# EAGLE design ESC試作 (EAGLE 9.6.2)
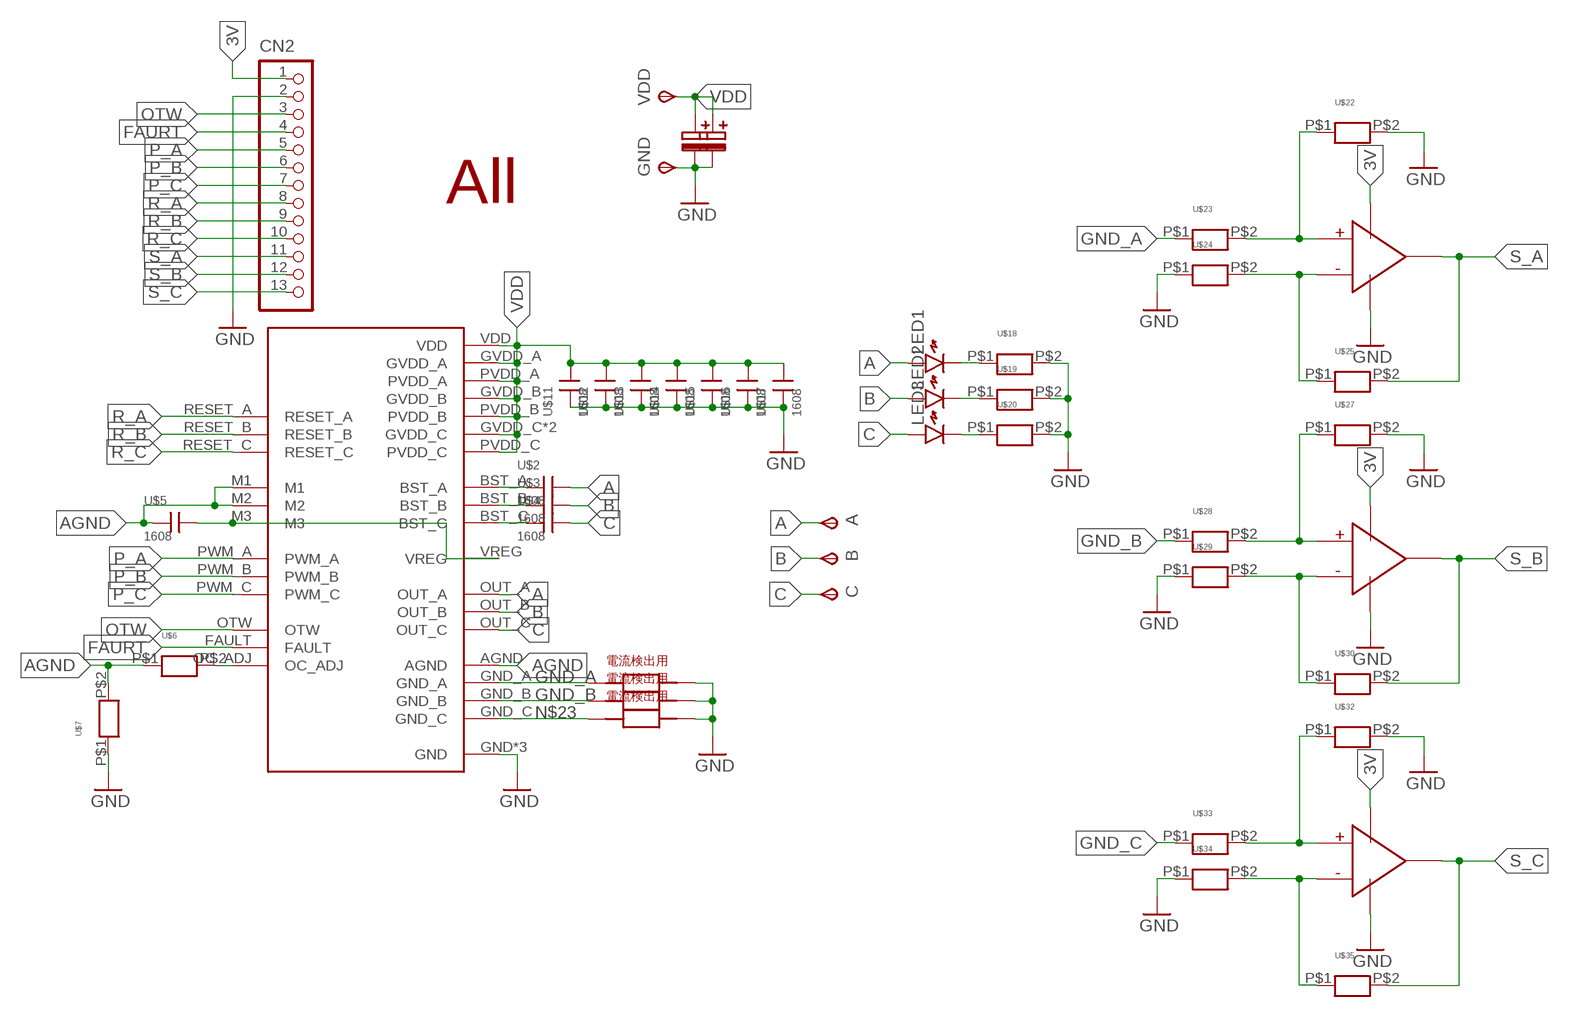
[diagram p0: schematic, sheet 1]

## Parts
A  TPSPAD1-20  [P1-20]
B  TPSPAD1-20  [P1-20]
C  TPSPAD1-20  [P1-20]
CN2  B13B-XH-A  [B13B-XH-A]
GND  TPSPAD1-20  [P1-20]
LED1  LED1608  [LED1608]
LED2  LED1608  [LED1608]
LED3  LED1608  [LED1608]
U$1  DRV8332  [DRV8332]
U$2  1608  [CON]
U$3  1608  [CON]
U$4  1608  [CON]
U$5  1608  [CON]
U$6  R  [1608]
U$7  R  [1608]
U$8  R0.1  [R0.1]
U$9  R0.1  [R0.1]
U$10  R0.1  [R0.1]
U$11  1608  [CON]
U$12  1608  [CON]
U$13  1608  [CON]
U$14  1608  [CON]
U$15  1608  [CON]
U$16  1608  [CON]
U$17  1608  [CON]
U$18  R  [1608]
U$19  R  [1608]
U$20  R  [1608]
U$21  77701  [77701]
U$22  R  [1608]
U$23  R  [1608]
U$24  R  [1608]
U$25  R  [1608]
U$26  77701  [77701]
U$27  R  [1608]
U$28  R  [1608]
U$29  R  [1608]
U$30  R  [1608]
U$31  77701  [77701]
U$32  R  [1608]
U$33  R  [1608]
U$34  R  [1608]
U$35  R  [1608]
U$36  25V100  [25V100]
U$37  25V100  [25V100]
U$38  ALL  [ALL]
VDD  TPSPAD1-20  [P1-20]

## Nets
3V: CN2.1 U$21.VIN U$26.VIN U$31.VIN
A: A.TP(PP) LED1.A U$1.OUT_A U$2.P$1
AGND: U$1.AGND U$1.M1 U$1.M2 U$5.P$2 U$6.P$1 U$7.P$2
B: B.TP(PP) LED2.A U$1.OUT_B U$3.P$1
C: C.TP(PP) LED3.A U$1.OUT_C U$4.P$1
FAURT: CN2.4 U$1.FAULT
GND: CN2.2 GND.TP(PP) U$1.GND U$1.GND1(GND) U$1.GND2(GND) U$7.P$1 U$8.P$2 U$9.P$2 U$10.P$2 U$11.P$2 U$12.P$2 U$13.P$2 U$14.P$2 U$15.P$2 U$16.P$2 U$17.P$2 U$18.P$2 U$19.P$2 U$20.P$2 U$21.VOUT U$22.P$2 U$24.P$1 U$26.VOUT U$27.P$2 U$29.P$1 U$31.VOUT U$32.P$2 U$34.P$1 U$36.P$2 U$37.P$2
GND_A: U$1.GND_A U$8.P$1 U$23.P$1
GND_B: U$1.GND_B U$9.P$1 U$28.P$1
GND_C: U$33.P$1
N$4: U$21.+ U$22.P$1 U$23.P$2
N$5: U$21.- U$24.P$2 U$25.P$1
N$6: U$1.M3 U$1.VREG U$5.P$1
N$7: LED3.K U$20.P$1
N$8: LED2.K U$19.P$1
N$9: LED1.K U$18.P$1
N$11: U$26.+ U$27.P$1 U$28.P$2
N$12: U$26.- U$29.P$2 U$30.P$1
N$13: U$31.+ U$32.P$1 U$33.P$2
N$14: U$31.- U$34.P$2 U$35.P$1
N$23: U$1.GND_C U$10.P$1
N$30: U$1.BST_A U$2.P$2
N$31: U$1.BST_B U$3.P$2
N$32: U$1.BST_C U$4.P$2
N$36: U$1.OC_ADJ U$6.P$2
OTW: CN2.3 U$1.OTW
P_A: CN2.5 U$1.PWM_A
P_B: CN2.6 U$1.PWM_B
P_C: CN2.7 U$1.PWM_C
R_A: CN2.8 U$1.RESET_A
R_B: CN2.9 U$1.RESET_B
R_C: CN2.10 U$1.RESET_C
S_A: CN2.11 U$21.O U$25.P$2
S_B: CN2.12 U$26.O U$30.P$2
S_C: CN2.13 U$31.O U$35.P$2
VDD: U$1.GVDD_A U$1.GVDD_B U$1.GVDD_C U$1.GVDD_C2(GVDD_C) U$1.PVDD_A U$1.PVDD_B U$1.PVDD_C U$1.VDD U$11.P$1 U$12.P$1 U$13.P$1 U$14.P$1 U$15.P$1 U$16.P$1 U$17.P$1 U$36.P$1 U$37.P$1 VDD.TP(PP)

## Library data of the parts
A B C GND VDD = testpad:TPS: TEST PIN
CN2 = jst-xh:B13B-XH-A: Wire-to-Board 2.5mm pitch top mount connector Source: http://www.jst-mfg.com/product/pdf/jpn/XH.pdf http://www.jst-mfg.com/product/detail.php?series=277
LED1-LED3 = generic:LED: Generic LEDs
U$1 = DRV8332:DRV8332
U$2-U$5 U$11-U$17 = con1608:1608
U$6 U$7 U$18-U$20 U$22-U$25 U$27-U$30 U$32-U$35 = R 1608:R
U$8-U$10 = R 1W0.1Ω:R0.1
U$21 U$26 U$31 = 77701:77701
U$36 U$37 = 100uF25V 電解:25V100
U$38 = All_outlook:ALL

## Net classes
0 default: width 0.33 mm

## Board
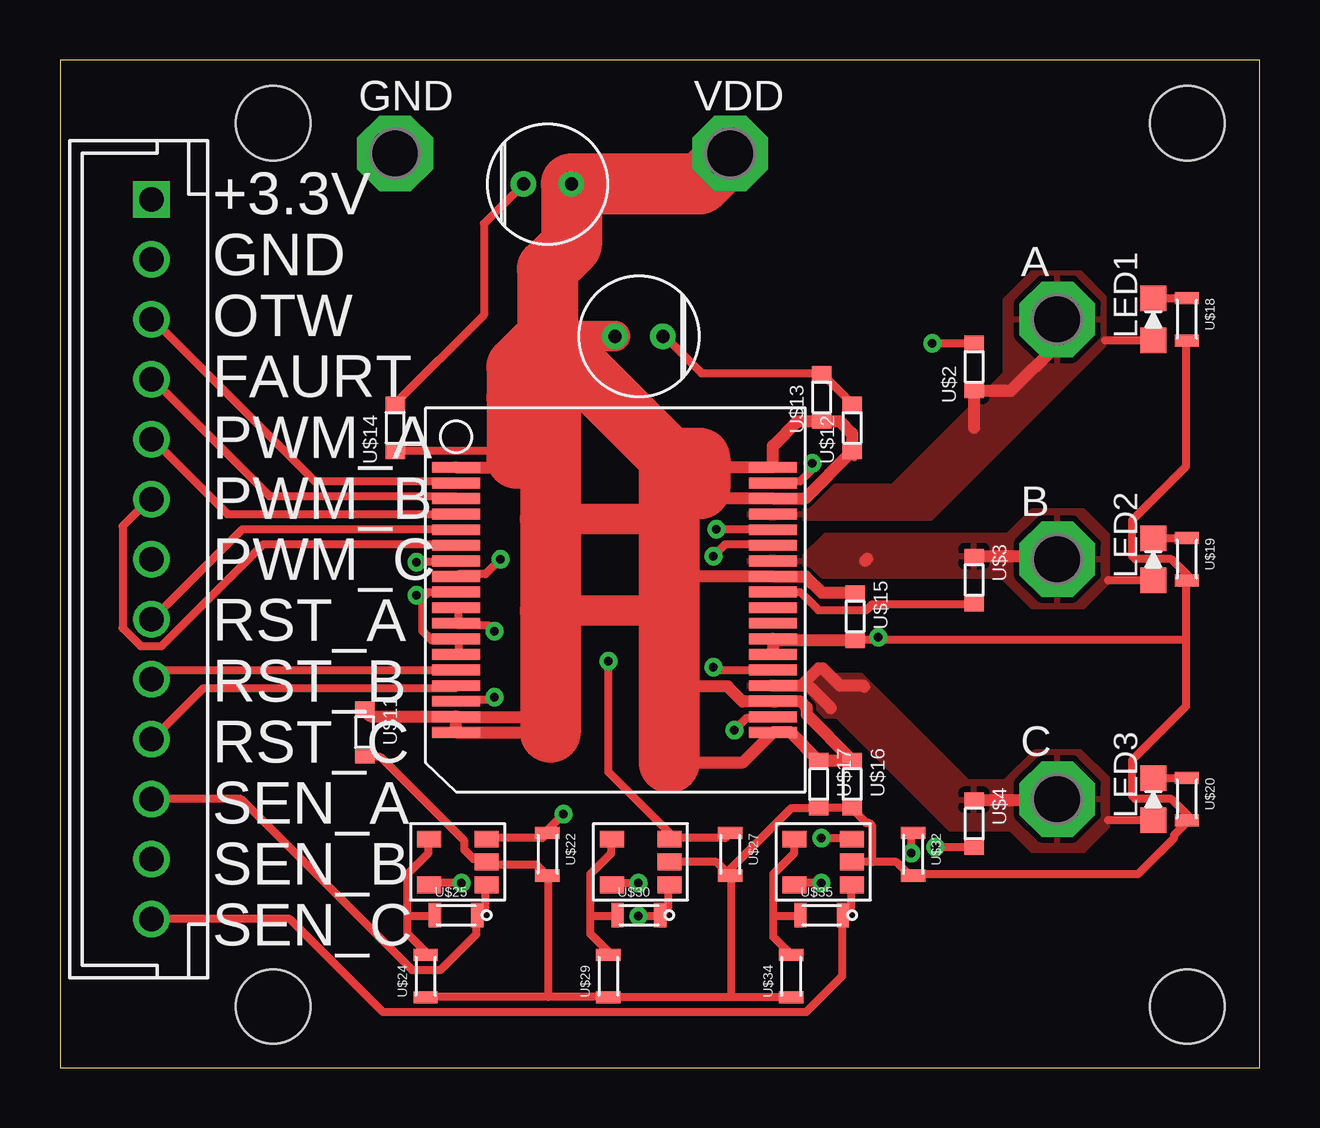
[diagram p1: board, top side]
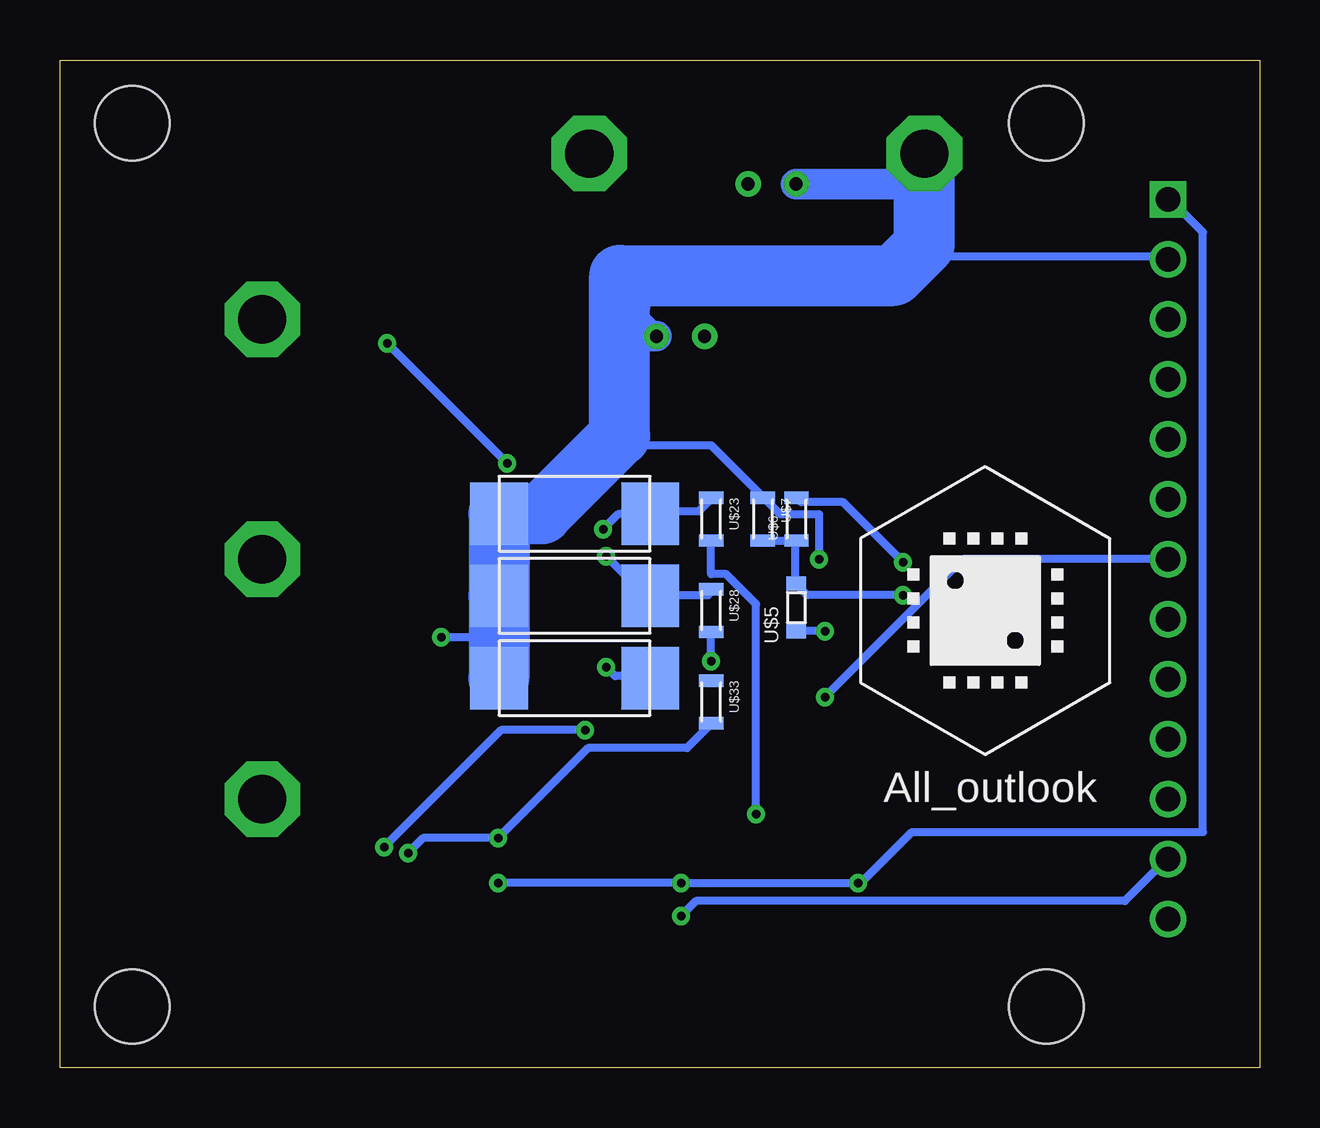
[diagram p2: board, bottom side, seen from below]

Size 50 x 42 mm. Coordinates in mm from the lower left corner, seen from the top.
Outline: 0,0 50,0 50,42 0,42 0,0
Copper layers (1*16): Top 0.035mm / dielectric 1.5mm / Bottom 0.035mm
Design rules "default": minimum track width 6mil, minimum drill 0.35mm, track to track 6mil, track to pad 6mil, pad to pad 6mil, via to via 6mil, smd to smd 6mil, copper to edge 40mil, drill to drill 6mil, minimum pad ring 10mil, minimum via ring 8mil, stop-mask expansion 4mil, vias tented up to drill 0mil, thermal gap 10mil
Holes 3.1 mm at 8.89,39.37 8.89,2.54 46.99,2.54 46.99,39.37

### Footprints (pad centres in the part's own frame; a part is rotated, then mirrored left to right if it is on the bottom)
P1-20 = drill 2.007 pad 3.15 octagon: TP 0,0
B13B-XH-A = drill 1.016 square: 1 -15,0 | drill 1.016: 2 -12.5,0; 3 -10,0; 4 -7.5,0; 5 -5,0; 6 -2.5,0; 7 0,0; 8 2.5,0; 9 5,0; 10 7.5,0; 11 10,0; 12 12.5,0; 13 15,0
LED1608 = smd 1.05 x 1.08: A -0.875,0; K 0.875,0
DRV8332 = smd 2 x 0.45: AGND 0,5.85; BST_A 13.2,10.4; BST_B 13.2,5.85; BST_C 13.2,0.65; FAULT 0,9.75; GND 0,6.5; GND1 13.2,3.9; GND2 13.2,3.25; GND_A 13.2,8.45; GND_B 13.2,7.8; GND_C 13.2,2.6; GVDD_A 13.2,11.05; GVDD_B 0,11.05; GVDD_C 0,0; GVDD_C2 13.2,0; M1 0,3.25; M2 0,3.9; M3 0,4.55; NC 13.2,5.2; NC2 13.2,4.55; OC_ADJ 0,7.15; OTW 0,10.4; OUT_A 13.2,9.1; OUT_B 13.2,7.15; OUT_C 13.2,1.95; PVDD_A 13.2,9.75; PVDD_B 13.2,6.5; PVDD_C 13.2,1.3; PWM_A 0,9.1; PWM_B 0,7.8; PWM_C 0,1.3; RESET_A 0,8.45; RESET_B 0,2.6; RESET_C 0,1.95; VDD 0,0.65; VREG 0,5.2
CON = smd 0.6 x 0.813: P$1 -1,0; P$2 1,0
1608 = smd 0.508 x 1.016: P$1 -0.889,0; P$2 0.889,0
R0.1 = smd 2.4 x 2.6: P$1 0,1.55; P$2 6.3,1.55
77701 = smd 0.7 x 1: + 1.9,0; - 1.9,2.4; O 0,0; VIN 0,2.4; VOUT 0.95,0
25V100 = drill 0.55: P$1 -1,0; P$2 1,0

### Placement (x,y rotation side)
A  41.57,31.19 0 top
B  41.57,21.19 0 top
C  41.57,11.19 0 top
CN2  3.81,21.19 270 top
GND  13.97,38.1 0 top
LED1  45.57,31.19 90 top
LED2  45.57,21.19 90 top
LED3  45.57,11.19 90 top
U$1  16.51,13.97 0 top
U$2  38.1,29.21 90 top
U$3  38.1,20.32 270 top
U$4  38.1,10.16 270 top
U$5  19.3,19.18 90 bottom
U$6  19.3,22.86 90 bottom
U$7  20.7,22.86 270 bottom
U$8  25.4,24.64 180 bottom
U$9  25.4,21.21 180 bottom
U$10  25.4,17.78 180 bottom
U$11  12.7,13.97 270 top
U$12  33.02,26.67 90 top
U$13  31.75,27.94 90 top
U$14  13.97,26.67 90 top
U$15  33.15,18.8 270 top
U$16  33.02,11.81 270 top
U$17  31.62,11.81 270 top
U$18  46.97,31.19 270 top
U$19  46.97,21.19 270 top
U$20  46.97,11.19 270 top
U$21  17.78,7.62 90 top
U$22  20.32,8.89 270 top
U$23  22.86,22.86 270 bottom
U$24  15.24,3.81 90 top
U$25  16.51,6.35 0 top
U$26  25.4,7.62 90 top
U$27  27.94,8.89 270 top
U$28  22.86,19.05 270 bottom
U$29  22.86,3.81 90 top
U$30  24.13,6.35 0 top
U$31  33.02,7.62 90 top
U$32  35.56,8.89 270 top
U$33  22.86,15.24 270 bottom
U$34  30.48,3.81 90 top
U$35  31.75,6.35 0 top
U$36  20.32,36.83 180 top
U$37  24.13,30.48 0 top
U$38  11.43,19.05 0 bottom
VDD  27.94,38.1 0 top

### Tracks (layer width: path | path; a pad name or v marks a point on that pad's centre or on a via)
3V  (via drill 0.35)
  Top 0.33: v16.73,7.69 15.48,7.69 U$21.VIN | v24.11,7.69 23.11,7.69 U$26.VIN | v31.73,7.69 30.73,7.69 U$31.VIN
  Bottom 0.33: v31.73,7.69 v24.11,7.69 v16.73,7.69 16.61,7.69 14.48,9.81 2.36,9.81 2.36,34.81 3.73,36.19 CN2.1
A
  Top 0.33: 43.56,30.32 LED1.A
  Top 0.508: A.TP 41.57,30.14 39.64,28.21 U$2.P$1 38.1,26.67
  pour Top: 28.7,23.24 28.7,22.86 36.32,22.86 43.56,30.1 43.56,32.13 42.55,33.15 40.51,33.15 39.37,32 39.37,28.96 34.67,24.26 32.26,24.26 31.24,23.24
AGND  (via drill 0.35)
  Top 0.33: U$1.M1 16.61,17.32 16.61,17.82 U$1.M2 16.36,17.82 15.48,17.82 15.11,18.19 15.11,19.57 | 15.11,19.57 15.36,19.82 16.48,19.82 U$1.AGND | v14.86,19.69 14.98,19.57 15.11,19.57
  Bottom 0.33: U$7.P$2 20.61,21.94 19.48,21.94 U$6.P$1 19.36,21.94 19.36,20.19 U$5.P$2 19.23,20.07 18.86,19.69 v14.86,19.69
B
  Top 0.33: 43.69,20.32 LED2.A
  Top 0.508: 33.57,21.12 33.66,21.21 | U$3.P$1 41.44,21.32 B.TP
  pour Top: 28.7,21.34 28.7,20.95 30.73,20.95 31.24,20.45 39.24,20.45 40.51,19.18 42.67,19.18 43.69,20.19 43.69,22.23 42.67,23.24 40.51,23.24 39.5,22.23 31.88,22.23 30.99,21.34
C
  Top 0.33: 43.69,10.31 LED3.A
  Top 0.508: 33.53,15.88 33.48,15.92 32.51,15.92 31.8,16.64 31.62,16.64 30.91,15.92 U$1.OUT_C 31.2,15.92 32.13,14.99 | U$4.P$1 41.54,11.16 C.TP
  pour Top: 28.7,15.75 30.73,15.75 31.88,14.61 32.38,14.61 37.08,9.91 39.62,9.91 40.51,9.02 42.67,9.02 43.69,10.03 43.69,12.06 42.55,13.21 40.64,13.21 39.37,11.94 37.85,11.94 33.4,16.38 31.11,16.38 30.86,16.13 28.7,16.13
FAURT
  Top 0.33: U$1.FAULT 16.48,23.82 8.73,23.82 3.86,28.69 CN2.4
GND  (via drill 0.35)
  Top 0.33: U$12.P$2 32.98,27.69 31.73,28.94 U$13.P$2 26.73,28.94 25.23,30.44 U$37.P$2 | U$14.P$2 17.67,31.37 17.67,35.18 U$36.P$2 | v18.36,21.19 17.73,20.57 16.61,20.57 U$1.GND | U$26.VOUT 25.48,8.56 27.36,8.56 27.86,8.06 U$27.P$2 | U$27.P$2 27.86,8.19 30.48,10.81 31.48,10.81 U$17.P$2 31.73,10.81 32.98,10.81 U$16.P$2 33.11,10.69 33.61,10.19 33.73,10.19 33.86,10.06 33.86,8.56 | U$11.P$2 12.73,12.94 13.36,12.94 16.86,9.44 16.86,9.06 17.23,8.69 17.73,8.69 U$21.VOUT 17.86,8.44 19.86,8.44 20.23,8.06 U$22.P$2 20.36,7.94 20.36,2.94 | 20.36,2.94 22.86,2.94 U$29.P$1 22.98,2.94 27.98,2.94 | 20.36,2.94 15.36,2.94 U$24.P$1 | 27.98,2.94 30.36,2.94 U$34.P$1 | 27.98,2.94 27.98,7.94 U$27.P$2 | 33.86,8.56 34.86,8.56 35.48,7.94 U$32.P$2 35.61,8.06 44.95,8.06 46.45,9.56 46.45,9.69 46.95,10.19 U$20.P$2 47.07,10.44 46.32,11.19 44.82,11.19 44.7,11.31 44.7,12.81 46.95,15.06 46.95,17.82 | 33.86,8.56 33.11,8.56 U$31.VOUT | 46.95,17.82 46.95,20.19 U$19.P$2 47.07,20.44 46.32,21.19 44.82,21.19 44.7,21.32 44.7,22.82 46.95,25.07 46.95,30.19 U$18.P$2 | 46.95,17.82 34.11,17.82 | 34.11,17.82 33.36,17.82 U$15.P$2 | v34.11,17.94 34.11,17.82
  Top 0.508: U$15.P$2 29.78,17.8 U$1.GND1 U$1.GND2
  Bottom 0.33: 26.67,26.34 25.48,25.94 22.86,25.94 20.73,23.82 U$7.P$1 20.61,23.69 19.98,23.07 18.36,23.07 v18.36,21.19 | CN2.2 3.86,33.69 3.98,33.81 12.79,33.81 13.97,34.29 | v34.11,17.94 31.7,17.94
  Bottom 1.27: U$37.P$2 25.4,30.48 26.67,31.75 | U$36.P$2 13.97,36.83
  Bottom 2.54: U$10.P$2 31.7,17.94 U$9.P$2 U$8.P$2 29.92,23.09 26.67,26.34 26.67,31.75 26.67,33.02 15.24,33.02 13.97,34.29 13.97,36.83 GND.TP
GND_A  (via drill 0.35)
  Top 0.33: v27.36,22.44 29.61,22.44 U$1.GND_A
  Bottom 0.33: U$23.P$1 22.86,23.69 23.36,23.19 25.36,23.19 U$8.P$1 25.48,23.07 26.73,23.07 v27.36,22.44
GND_B  (via drill 0.35)
  Top 0.33: v27.23,21.32 27.73,21.82 29.61,21.82 U$1.GND_B
  Bottom 0.33: U$28.P$1 22.86,19.82 22.98,19.69 25.36,19.69 U$9.P$1 25.48,19.69 25.61,19.69 v27.23,21.32
N$4  (via drill 0.35)
  Top 0.33: U$21.+ 17.86,9.56 20.11,9.56 20.23,9.69 U$22.P$1 20.36,9.94 v20.98,10.56
  Bottom 0.33: U$23.P$2 22.86,20.57 22.23,20.57 20.98,19.32 v20.98,10.56
N$5
  Top 0.33: 14.48,6.32 14.48,5.57 15.23,4.82 U$24.P$2 | 14.48,6.32 14.48,8.06 15.36,8.94 15.36,9.44 U$21.- | 14.48,6.32 15.61,6.32 U$25.P$1
N$6  (via drill 0.35)
  Top 0.33: v18.11,18.19 17.86,18.44 16.61,18.44 U$1.M3 16.61,18.57 16.61,19.07 U$1.VREG
  Bottom 0.33: v18.11,18.19 19.23,18.19 U$5.P$1
N$7
  Top 0.33: LED3.K 46.95,12.06 U$20.P$1
N$8
  Top 0.33: LED2.K 46.95,22.07 U$19.P$1
N$9
  Top 0.33: LED1.K 46.95,32.06 U$18.P$1
N$11  (via drill 0.35)
  Top 0.33: U$27.P$1 27.86,9.69 27.73,9.56 25.48,9.56 U$26.+ 25.48,9.69 22.86,12.31 v22.86,16.94
  Bottom 0.33: v22.86,16.94 U$28.P$2
N$12
  Top 0.33: 22.11,6.32 22.11,5.57 22.86,4.82 U$29.P$2 | 22.11,6.32 22.11,8.06 22.98,8.94 22.98,9.44 U$26.- | 22.11,6.32 23.23,6.32 U$30.P$1
N$13  (via drill 0.35)
  Top 0.33: v31.73,9.56 32.98,9.56 U$31.+ | v35.48,8.94 35.48,9.69 U$32.P$1
  Bottom 0.33: U$33.P$2 22.86,14.31 23.86,13.31 27.98,13.31 v31.73,9.56 34.86,9.56 v35.48,8.94
N$14
  Top 0.33: 29.73,6.32 29.73,5.44 30.36,4.82 U$34.P$2 | 29.73,6.32 29.73,8.06 30.61,8.94 30.61,9.44 U$31.- | 29.73,6.32 30.86,6.32 U$35.P$1
N$23  (via drill 0.35)
  Top 0.33: v27.23,16.69 27.36,16.57 29.61,16.57 U$1.GND_C
  Bottom 0.33: v27.23,16.69 26.86,16.32 25.48,16.32 U$10.P$1
N$30  (via drill 0.35)
  Top 0.33: v36.36,30.19 38.07,30.19 U$2.P$2 | v31.36,25.19 31.36,24.94 30.86,24.44 29.73,24.44 U$1.BST_A
  Bottom 0.33: v31.36,25.19 v36.36,30.19
N$31
  Top 0.33: U$3.P$2 38.07,19.32 33.86,19.32 33.61,19.07 31.61,19.07 30.86,19.82 29.73,19.82 U$1.BST_B
N$32  (via drill 0.35)
  Top 0.33: v36.48,9.19 38.07,9.19 U$4.P$2 | v28.11,14.06 28.61,14.56 29.61,14.56 U$1.BST_C
  Bottom 0.33: v36.48,9.19 31.61,14.06 v28.11,14.06
N$36  (via drill 0.35)
  Top 0.33: v14.86,21.07 16.48,21.07 U$1.OC_ADJ
  Bottom 0.33: v14.86,21.07 17.36,23.57 19.11,23.57 19.23,23.69 U$6.P$2
OTW
  Top 0.33: U$1.OTW 16.48,24.44 10.61,24.44 3.86,31.19 CN2.3
P_A
  Top 0.33: U$1.PWM_A 16.48,23.07 6.99,23.07 3.86,26.19 CN2.5
P_B
  Top 0.33: U$1.PWM_B 16.48,21.82 8.48,21.82 4.24,17.57 3.36,17.57 2.61,18.32 2.61,22.57 3.73,23.69 CN2.6
P_C  (via drill 0.35)
  Top 0.33: v18.11,15.44 17.98,15.31 16.61,15.31 U$1.PWM_C
  Bottom 0.33: v18.11,15.44 12.36,21.19 CN2.7
R_A
  Top 0.33: U$1.RESET_A 16.48,22.44 7.61,22.44 3.86,18.69 CN2.8
R_B
  Top 0.33: U$1.RESET_B 16.48,16.57 4.24,16.57 3.86,16.19 CN2.9
R_C
  Top 0.33: U$1.RESET_C 16.48,15.81 5.99,15.81 3.86,13.69 CN2.10
S_A
  Top 0.33: U$21.O 17.73,7.57 17.73,6.69 17.48,6.44 U$25.P$2 17.36,6.19 17.36,5.57 15.86,4.07 14.67,4.07 7.54,11.19 CN2.11
S_B  (via drill 0.35)
  Top 0.33: U$26.O 25.36,7.57 25.36,6.69 25.11,6.44 U$30.P$2 24.86,6.32 v24.11,6.32
  Bottom 0.33: v24.11,6.32 23.48,6.94 5.61,6.94 3.86,8.69 CN2.12
S_C
  Top 0.33: U$31.O 32.98,7.57 32.98,6.69 32.73,6.44 U$35.P$2 32.61,6.19 32.61,3.81 31.11,2.31 13.45,2.31 9.57,6.19 CN2.13
VDD
  Top 0.33: 19.05,25.69 13.98,25.69 U$14.P$1 | 33.11,25.44 U$12.P$1 | 33.36,19.69 U$15.P$1
  Top 0.508: U$15.P$1 31.75,19.8 31.08,20.47 U$1.PVDD_B 25.55,20.47 25.4,20.32 | 26.67,25.4 27.05,25.02 U$1.GVDD_A 29.71,25.92 30.73,26.94 U$13.P$1 32.51,26.94 33.02,26.43 U$12.P$1 31.07,23.72 U$1.PVDD_A 27.59,23.72 26.67,24.64 | 26.67,24.13 25.4,25.4 | 25.4,12.7 28.44,12.7 U$1.GVDD_C2 30.46,13.97 U$17.P$1 U$16.P$1 31.12,14.71 31.12,15.01 30.88,15.25 29.86,15.25 29.86,15.26 29.72,15.26 | U$1.PVDD_C 29.72,15.26 | 29.72,15.26 28.45,15.26 27.82,15.89 25.4,15.89 | 20.07,13.97 U$1.GVDD_C U$1.VDD | 20.07,13.97 20.45,13.97 | U$1.VDD 19.42,14.62 20.07,13.97 | U$1.GVDD_B 18.67,25.02 19.05,25.4 | 19.05,27.94 20.45,29.34 | U$1.VDD 16.49,14.64 12.93,14.64 12.7,14.87 U$11.P$1
  Top 1.27: U$37.P$1 20.32,30.48 | 21.46,36.83 21.72,37.08 21.57,37.08 U$36.P$1 | 20.45,19.05 25.4,19.05 | 20.45,22.86 25.4,22.86
  Top 2.54: VDD.TP 26.67,36.83 21.46,36.83 | U$36.P$1 21.32,34.29 20.32,33.29 20.32,30.48 | 19.05,25.4 19.05,25.69 19.05,27.94 19.05,29.21 20.32,30.48 | 20.45,29.34 20.45,22.86 20.45,19.05 20.45,13.97 | 20.32,30.48 25.4,25.4 | 25.4,25.4 26.67,25.4 26.67,24.64 26.67,24.13 | 25.4,12.7 25.4,15.89 25.4,19.05 25.4,20.32 25.4,22.86 25.4,25.4

### Text on the board
tPlace: +3.3V | GND | OTW | FAURT | PWM_A | PWM_B | PWM_C | RST_A | RST_B | RST_C | SEN_A | SEN_B | SEN_C